# Altium project IBB.PrjPcb (part 11 of 12)
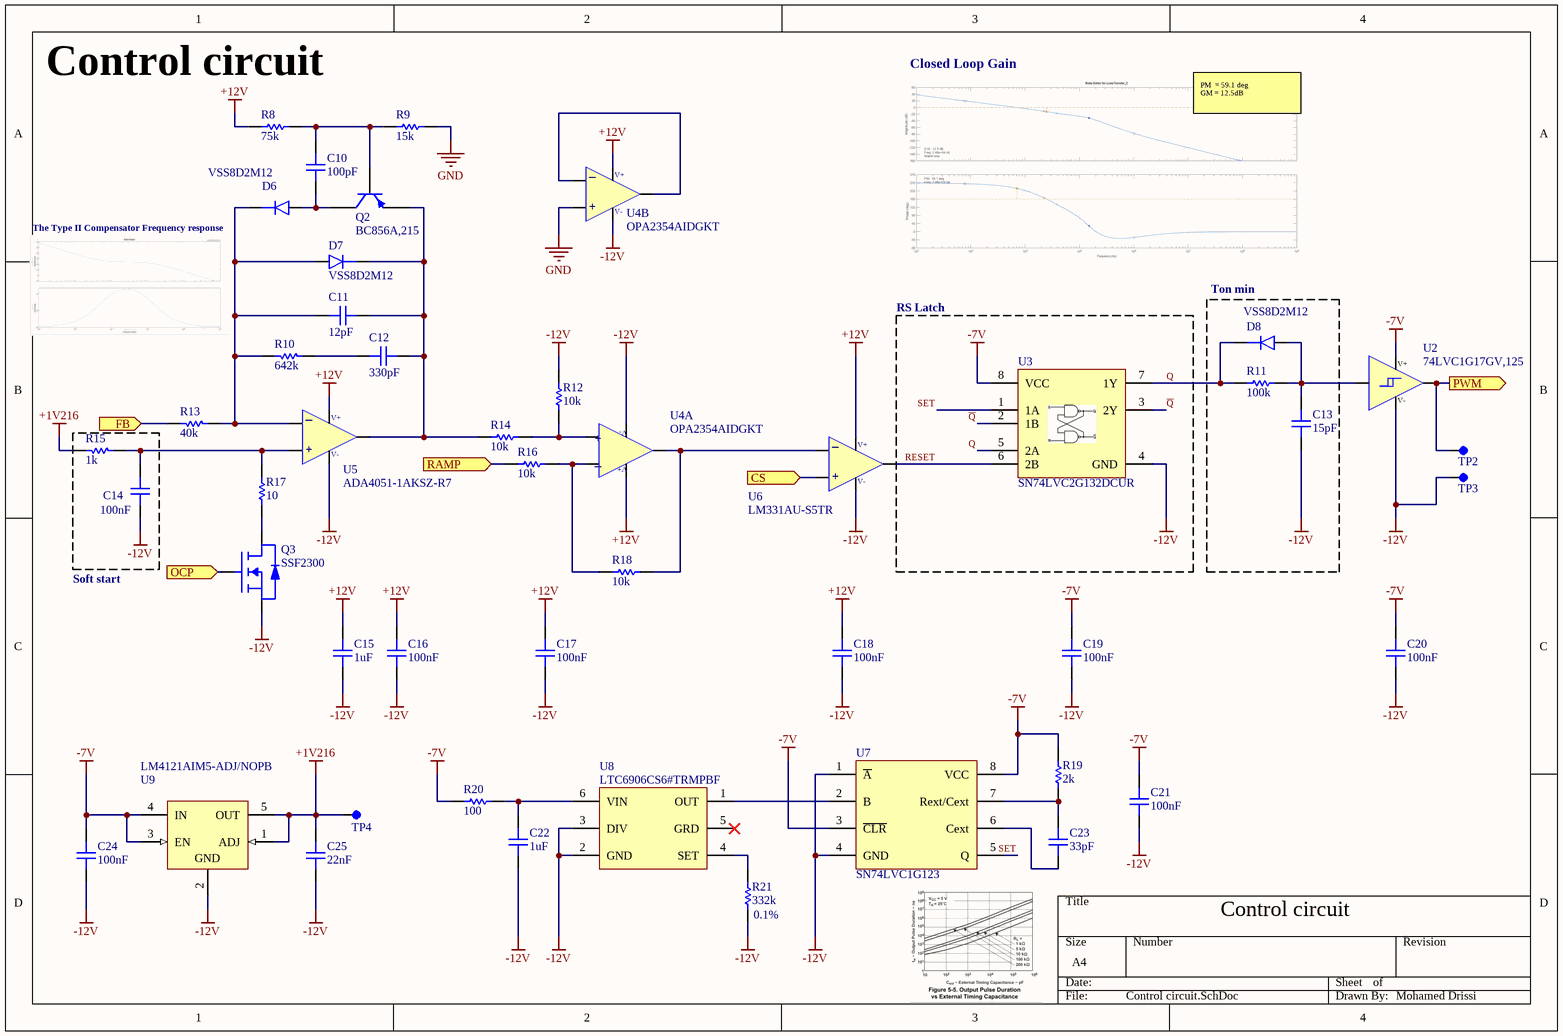
[diagram p16: Control circuit.SchDoc]

## Sheet Control circuit.SchDoc (continued)

### Library data of the parts (continued)
R12 R14 R16 R18 = Panasonic ERA-3AEB103V: Res Thin Film 0603 10K Ohm 0.1% 1/10W ±25ppm/°C Molded SMD SMD Punched Carrier T/R; Manufacturer Lifecycle Status: ACTIVE; Part Series: Thin Film Chip Resistors, High Reliability Type; Max Power Dissipation: 100mW; Voltage Rating: 75V; Supplier: RS; Supplier Part Number: 566890P; Manufacturer: Panasonic; Manufacturer Part Number: ERA-3AEB103V; RoHS: Compliant; Category: Chip SMD Resistors; Stock: 165600; Pricing: 50=0,056, 100=0,046, 250=0,04, 500=0,036 (EUR); Case/Package: 0603; Case Code (Imperial): 0603; Composition: Thin Film; Contact Plating: Tin; Country of Origin: Japan; Depth: 800µm; Export Control Classification Number (ECCN) Code: EAR99; Height: 450µm; Harmonized Tariff Schedule (HTS) Code: 8533.21.00.30; Introduction Date: 2008-03-19; Lead Free: Lead Free; Length: 1.6mm; Lifecycle Status: Production; Max Operating Temperature: 155°C; Military Standard: Not; Min Operating Temperature: -55°C; Mounting Technology: Surface Mount; Pins: 2; Number of Terminals: 2; Number of Terminations: 2; Packaging: Cut Tape; Power Rating: 100mW; Radiation Hardening: No; Ratings: AEC-Q200; REACH SVHC: Yes; Schedule B: 8533210045, 8533210045|8533210045|8533210045|8533210045|8533210045|8533210045|8533210045|8533210045|8533210045|8533210045|8533210045|8533210045|8533210045|8533210045|8533210045|8533210045|8533210045|8533210045|8533210045|8533210045|8533210045|8533210045|8533210045|85; Temperature Coefficient: 25ppm/°C; Termination: SMD/SMT; Tolerance: 0.1%; Voltage Rating (DC): 75V; Width: 800µm; Working Voltage: 75V; ComponentLink1URL: https://datasheet.octopart.com:443/ERA-3AEB103V-Panasonic-datasheet-62287448.pdf?src-supplier=Newark; ComponentLink1Description: https://datasheet.octopart.com:443/ERA-3AEB103V-Panasonic-datasheet-62287448.pdf?src-supplier=Newark; ComponentLink2URL: https://datasheet.octopart.com:443/ERA-3AEB103V-Panasonic-datasheet-118567.pdf?src-supplier=Newark; ComponentLink2Description: https://datasheet.octopart.com:443/ERA-3AEB103V-Panasonic-datasheet-118567.pdf?src-supplier=Newark; ComponentLink3URL: https://datasheet.octopart.com:443/ERA-3AEB103V-Panasonic-datasheet-61114971.pdf?src-supplier=Newark; ComponentLink3Description: https://datasheet.octopart.com:443/ERA-3AEB103V-Panasonic-datasheet-61114971.pdf?src-supplier=Newark; ComponentLink4URL: https://datasheet.octopart.com:443/ERA3AEB103V-Panasonic-datasheet-22087624.pdf?src-supplier=Newark; ComponentLink4Description: https://datasheet.octopart.com:443/ERA3AEB103V-Panasonic-datasheet-22087624.pdf?src-supplier=Newark; ComponentLink5URL: https://sigma.octopart.com:443/138766958/technical_drawing/Panasonic-ERA-3AEB103V.pdf?src-supplier=Upverter; ComponentLink5Description: https://sigma.octopart.com:443/138766958/technical_drawing/Panasonic-ERA-3AEB103V.pdf?src-supplier=Upverter; ComponentLink6URL: https://datasheet.octopart.com:443/ERA-3AEB103V-Panasonic-datasheet-136531316.pdf?src-supplier=Farnell; ComponentLink6Description: https://datasheet.octopart.com:443/ERA-3AEB103V-Panasonic-datasheet-136531316.pdf?src-supplier=Farnell; ComponentLink7URL: https://datasheet.octopart.com:443/ERA-3AEB103V-Panasonic-datasheet-13266200.pdf?src-supplier=RS+(Formerly+Allied+Electronics); ComponentLink7Description: https://datasheet.octopart.com:443/ERA-3AEB103V-Panasonic-datasheet-13266200.pdf?src-supplier=RS+(Formerly+Allied+Electronics); ComponentLink8URL: https://datasheet.octopart.com:443/ERA-3AEB103V-Panasonic-datasheet-46744048.pdf?src-supplier=RS+(Formerly+Allied+Electronics); ComponentLink8Description: https://datasheet.octopart.com:443/ERA-3AEB103V-Panasonic-datasheet-46744048.pdf?src-supplier=RS+(Formerly+Allied+Electronics); ComponentLink9URL: https://datasheet.octopart.com:443/ERA-3AEB103V-Panasonic-datasheet-10840895.pdf?src-supplier=Future+Electronics; ComponentLink9Description: https://datasheet.octopart.com:443/ERA-3AEB103V-Panasonic-datasheet-10840895.pdf?src-supplier=Future+Electronics; ComponentLink10URL: https://datasheet.octopart.com:443/ERA-3AEB103V-Panasonic-datasheet-8367715.pdf?src-supplier=Future+Electronics; ComponentLink10Description: https://datasheet.octopart.com:443/ERA-3AEB103V-Panasonic-datasheet-8367715.pdf?src-supplier=Future+Electronics; ComponentLink11URL: https://datasheet.octopart.com:443/ERA-3AEB103V-Panasonic-datasheet-12510007.pdf?src-supplier=Future+Electronics; ComponentLink11Description: https://datasheet.octopart.com:443/ERA-3AEB103V-Panasonic-datasheet-12510007.pdf?src-supplier=Future+Electronics; ComponentLink12URL: https://datasheet.octopart.com:443/ERA-3AEB103V-Panasonic-datasheet-11763931.pdf?src-supplier=Future+Electronics; ComponentLink12Description: https://datasheet.octopart.com:443/ERA-3AEB103V-Panasonic-datasheet-11763931.pdf?src-supplier=Future+Electronics; ComponentLink13URL: https://datasheet.octopart.com:443/ERA-3AEB103V-Panasonic-datasheet-5392808.pdf?src-supplier=Future+Electronics; ComponentLink13Description: https://datasheet.octopart.com:443/ERA-3AEB103V-Panasonic-datasheet-5392808.pdf?src-supplier=Future+Electronics; ComponentLink14URL: https://datasheet.octopart.com:443/ERA-3AEB103V-Panasonic-datasheet-154766165.pdf?src-supplier=Master+Electronics; ComponentLink14Description: https://datasheet.octopart.com:443/ERA-3AEB103V-Panasonic-datasheet-154766165.pdf?src-supplier=Master+Electronics; ComponentLink15URL: https://datasheet.octopart.com:443/ERA3AEB103V-Panasonic-datasheet-188913046.pdf?src-supplier=TME; ComponentLink15Description: https://datasheet.octopart.com:443/ERA3AEB103V-Panasonic-datasheet-188913046.pdf?src-supplier=TME; ComponentLink16URL: https://sigma.octopart.com:443/150570796/technical_drawing/Panasonic-ERA3AEB103V.pdf?src-supplier=Panasonic+SCT; ComponentLink16Description: https://sigma.octopart.com:443/150570796/technical_drawing/Panasonic-ERA3AEB103V.pdf?src-supplier=Panasonic+SCT; ComponentLink17URL: https://datasheet.octopart.com:443/ERA3AEB103V-Panasonic-datasheet-138783076.pdf?src-supplier=Burklin+Elektronik; ComponentLink17Description: https://datasheet.octopart.com:443/ERA3AEB103V-Panasonic-datasheet-138783076.pdf?src-supplier=Burklin+Elektronik; ComponentLink18URL: https://datasheet.octopart.com/ERA-3AEB103V-Panasonic-datasheet-78375410.pdf; ComponentLink18Description: https://datasheet.octopart.com/ERA-3AEB103V-Panasonic-datasheet-78375410.pdf; ComponentLink19URL: https://datasheet.octopart.com:443/ERA-3AEB103V-Panasonic-datasheet-10050158.pdf?src-supplier=Arrow+Electronics; ComponentLink19Description: https://datasheet.octopart.com:443/ERA-3AEB103V-Panasonic-datasheet-10050158.pdf?src-supplier=Arrow+Electronics; ComponentLink20URL: https://datasheet.octopart.com:443/ERA-3AEB103V-Panasonic-datasheet-33006989.pdf?src-supplier=Electro+Sonic; ComponentLink20Description: https://datasheet.octopart.com:443/ERA-3AEB103V-Panasonic-datasheet-33006989.pdf?src-supplier=Electro+Sonic
R13 = Yageo AT0603BRD0740KL: 100mW Thin Film Resistor ±25ppm/℃ ±0.1% 40kΩ 0603 Chip Resistor - Surface Mount ROHS; Manufacturer: Yageo Group; Temperature Coefficient: 25ppm/°C; Voltage Rating: 75V; Supplier: Farnell; Supplier Part Number: AT0603BRD0740KL; Manufacturer Part Number: AT0603BRD0740KL; RoHS: Compliant; Category: Chip SMD Resistors; Stock: 3360; Pricing: 10=0,106, 100=0,0857, 500=0,0736, 1000=0,0731, 2500=0,0726, 5000=0,0721 (GBP); Case/Package: 0603; China RoHS: Compliant; Composition: Thin Film; Country of Origin: Mainland China, Taiwan; Export Control Classification Number (ECCN) Code: EAR99; Height: 450µm; Harmonized Tariff Schedule (HTS) Code: 8533.21.00.30; Introduction Date: 2023-09-04; Length: 1.6mm; Lifecycle Status: Production; Max Operating Temperature: 155°C; Min Operating Temperature: -55°C; Mounting Technology: Surface Mount; Number of Terminals: 2; Power Rating: 100mW; Ratings: AEC-Q200; REACH SVHC: Yes; Tolerance: 0.1%; Width: 800µm; Working Voltage: 75V; ComponentLink1URL: https://datasheet.octopart.com:443/AT0603BRD0740KL-Yageo-datasheet-182189409.pdf?src-supplier=IHS; ComponentLink1Description: https://datasheet.octopart.com:443/AT0603BRD0740KL-Yageo-datasheet-182189409.pdf?src-supplier=IHS; ComponentLink2URL: https://datasheet.octopart.com:443/AT0603BRD0740KL-Yageo-datasheet-153645570.pdf?src-supplier=Upverter; ComponentLink2Description: https://datasheet.octopart.com:443/AT0603BRD0740KL-Yageo-datasheet-153645570.pdf?src-supplier=Upverter; ComponentLink3URL: https://sigma.octopart.com:443/138820526/technical_drawing/Yageo-AT0603BRD0740KL.pdf?src-supplier=Upverter; ComponentLink3Description: https://sigma.octopart.com:443/138820526/technical_drawing/Yageo-AT0603BRD0740KL.pdf?src-supplier=Upverter; ComponentLink4URL: https://datasheet.octopart.com:443/AT0603BRD0740KL-Yageo-datasheet-178056449.pdf?src-supplier=element14+APAC; ComponentLink4Description: https://datasheet.octopart.com:443/AT0603BRD0740KL-Yageo-datasheet-178056449.pdf?src-supplier=element14+APAC; ComponentLink5URL: http://sigma.octopart.com:80/conflict_mineral_statement/Yageo-company-3.pdf?src-supplier=Compliance+Statements; ComponentLink5Description: http://sigma.octopart.com:80/conflict_mineral_statement/Yageo-company-3.pdf?src-supplier=Compliance+Statements; ComponentLink6URL: http://sigma.octopart.com:80/rohs_statement/Yageo-company-2.pdf?src-supplier=Compliance+Statements; ComponentLink6Description: http://sigma.octopart.com:80/rohs_statement/Yageo-company-2.pdf?src-supplier=Compliance+Statements
R15 = Yageo RC0603FR-071KL: Res Thick Film 0603 1K Ohm 1% 0.1W(1/10W) ±100ppm/°C Pad SMD T/R / RES SMD 1K OHM 1% 1/10W 0603; Manufacturer: Yageo Group; Power Rating: 100mW; Voltage Rating: 50V; Working Voltage: 75V; Supplier: RS; Supplier Part Number: 1995479P; Manufacturer Part Number: RC0603FR-071KL; RoHS: Compliant; Category: Chip SMD Resistors; Stock: 83300; Pricing: 1000=0,007, 2500=0,007, 5000=0,006, 10000=0,005 (EUR); Case/Package: 0603; Case Code (Imperial): 0603; Case Code (Metric): 0603; China RoHS: Non-Compliant; Composition: Thick Film; Contact Plating: Tin; Country of Origin: Mainland China, Taiwan; Depth: 800µm; Export Control Classification Number (ECCN) Code: EAR99; Height: 450µm; Harmonized Tariff Schedule (HTS) Code: 8533.21.00.30; Introduction Date: 2004-10-04; Lead Free: Lead Free; Length: 1.6mm; Lifecycle Status: Production; Max Operating Temperature: 155°C; Military Standard: Not; Min Operating Temperature: -55°C; Mounting Technology: Surface Mount; Pins: 2; Number of Terminals: 2; Packaging: Tape and Reel; Radiation Hardening: No; REACH SVHC: Yes; Schedule B: 8533210045, 8533210045|8533210045|8533210045|8533210045|8533210045|8533210045|8533210045|8533210045|8533210045|8533210045|8533210045|8533210045|8533210045|8533210045|8533210045|8533210045|8533210045|8533210045|8533210045|8533210045|8533210045|8533210045|8533210045|85; Temperature Coefficient: 100ppm/°C; Termination: SMD/SMT; Tolerance: 1%; Voltage Rating (DC): 50V; Width: 800µm; ComponentLink1URL: https://datasheet.octopart.com:443/RC0603FR-071KL-Yageo-datasheet-175887523.pdf?src-supplier=Newark; ComponentLink1Description: https://datasheet.octopart.com:443/RC0603FR-071KL-Yageo-datasheet-175887523.pdf?src-supplier=Newark; ComponentLink2URL: https://datasheet.octopart.com:443/RC0603FR-071KL-Yageo-datasheet-34211833.pdf?src-supplier=Newark; ComponentLink2Description: https://datasheet.octopart.com:443/RC0603FR-071KL-Yageo-datasheet-34211833.pdf?src-supplier=Newark; ComponentLink3URL: https://datasheet.octopart.com:443/RC0603FR-071KL-Yageo-datasheet-12596169.pdf?src-supplier=Newark; ComponentLink3Description: https://datasheet.octopart.com:443/RC0603FR-071KL-Yageo-datasheet-12596169.pdf?src-supplier=Newark; ComponentLink4URL: https://datasheet.octopart.com:443/RC0603FR-071KL-Yageo-datasheet-499455.pdf?src-supplier=Newark; ComponentLink4Description: https://datasheet.octopart.com:443/RC0603FR-071KL-Yageo-datasheet-499455.pdf?src-supplier=Newark; ComponentLink5URL: https://datasheet.octopart.com:443/RC0603FR-071KL-Yageo-datasheet-503470.pdf?src-supplier=Newark; ComponentLink5Description: https://datasheet.octopart.com:443/RC0603FR-071KL-Yageo-datasheet-503470.pdf?src-supplier=Newark; ComponentLink6URL: https://datasheet.octopart.com:443/RC0603FR-071KL-Yageo-datasheet-62067350.pdf?src-supplier=element14+APAC; ComponentLink6Description: https://datasheet.octopart.com:443/RC0603FR-071KL-Yageo-datasheet-62067350.pdf?src-supplier=element14+APAC; ComponentLink7URL: https://datasheet.octopart.com:443/RC0603FR-071KL-Yageo-datasheet-21426514.pdf?src-supplier=element14+APAC; ComponentLink7Description: https://datasheet.octopart.com:443/RC0603FR-071KL-Yageo-datasheet-21426514.pdf?src-supplier=element14+APAC; ComponentLink8URL: https://datasheet.octopart.com:443/RC0603FR-071KL-Yageo-datasheet-141265859.pdf?src-supplier=Upverter; ComponentLink8Description: https://datasheet.octopart.com:443/RC0603FR-071KL-Yageo-datasheet-141265859.pdf?src-supplier=Upverter; ComponentLink9URL: https://datasheet.octopart.com:443/RC0603FR-071KL-Yageo-datasheet-103092701.pdf?src-supplier=Upverter; ComponentLink9Description: https://datasheet.octopart.com:443/RC0603FR-071KL-Yageo-datasheet-103092701.pdf?src-supplier=Upverter; ComponentLink10URL: https://sigma.octopart.com:443/138820526/technical_drawing/Yageo-RC0603FR-071KL.pdf?src-supplier=Upverter; ComponentLink10Description: https://sigma.octopart.com:443/138820526/technical_drawing/Yageo-RC0603FR-071KL.pdf?src-supplier=Upverter; ComponentLink11URL: https://datasheet.octopart.com:443/RC0603FR-071KL-Yageo-datasheet-68297981.pdf?src-supplier=Upverter; ComponentLink11Description: https://datasheet.octopart.com:443/RC0603FR-071KL-Yageo-datasheet-68297981.pdf?src-supplier=Upverter; ComponentLink12URL: https://datasheet.octopart.com:443/RC0603FR-071KL-Yageo-datasheet-8328172.pdf?src-supplier=Farnell; ComponentLink12Description: https://datasheet.octopart.com:443/RC0603FR-071KL-Yageo-datasheet-8328172.pdf?src-supplier=Farnell; ComponentLink13URL: https://datasheet.octopart.com:443/RC0603FR-071KL-Yageo-datasheet-13691069.pdf?src-supplier=Farnell; ComponentLink13Description: https://datasheet.octopart.com:443/RC0603FR-071KL-Yageo-datasheet-13691069.pdf?src-supplier=Farnell; ComponentLink14URL: https://datasheet.octopart.com:443/RC0603FR-071KL-Yageo-datasheet-15599030.pdf?src-supplier=Seeed+Studio; ComponentLink14Description: https://datasheet.octopart.com:443/RC0603FR-071KL-Yageo-datasheet-15599030.pdf?src-supplier=Seeed+Studio; ComponentLink15URL: https://datasheet.octopart.com:443/RC0603FR-071KL-Yageo-Group-datasheet-176638170.pdf?src-supplier=Future+Electronics; ComponentLink15Description: https://datasheet.octopart.com:443/RC0603FR-071KL-Yageo-Group-datasheet-176638170.pdf?src-supplier=Future+Electronics; ComponentLink16URL: https://datasheet.octopart.com:443/RC0603FR-071KL-Yageo-datasheet-164759695.pdf?src-supplier=Future+Electronics; ComponentLink16Description: https://datasheet.octopart.com:443/RC0603FR-071KL-Yageo-datasheet-164759695.pdf?src-supplier=Future+Electronics; ComponentLink17URL: https://datasheet.octopart.com:443/RC0603FR-071KL-Yageo-datasheet-137700087.pdf?src-supplier=Future+Electronics; ComponentLink17Description: https://datasheet.octopart.com:443/RC0603FR-071KL-Yageo-datasheet-137700087.pdf?src-supplier=Future+Electronics; ComponentLink18URL: https://datasheet.octopart.com:443/RC0603FR071KL-Yageo-datasheet-27584510.pdf?src-supplier=Future+Electronics; ComponentLink18Description: https://datasheet.octopart.com:443/RC0603FR071KL-Yageo-datasheet-27584510.pdf?src-supplier=Future+Electronics; ComponentLink19URL: https://datasheet.octopart.com:443/RC0603FR-071KL-Yageo-datasheet-8324193.pdf?src-supplier=Future+Electronics; ComponentLink19Description: https://datasheet.octopart.com:443/RC0603FR-071KL-Yageo-datasheet-8324193.pdf?src-supplier=Future+Electronics; ComponentLink20URL: https://datasheet.octopart.com:443/RC0603FR-071KL-Yageo-datasheet-79472498.pdf?src-supplier=Megastar; ComponentLink20Description: https://datasheet.octopart.com:443/RC0603FR-071KL-Yageo-datasheet-79472498.pdf?src-supplier=Megastar; ComponentLink21URL: https://datasheet.octopart.com/RC0603FR-071KL-Yageo-datasheet-73766026.pdf; ComponentLink21Description: https://datasheet.octopart.com/RC0603FR-071KL-Yageo-datasheet-73766026.pdf; ComponentLink22URL: https://datasheet.octopart.com:443/RC0603FR-071KL-Yageo-datasheet-118562.pdf?src-supplier=DigiKey; ComponentLink22Description: https://datasheet.octopart.com:443/RC0603FR-071KL-Yageo-datasheet-118562.pdf?src-supplier=DigiKey; ComponentLink23URL: http://sigma.octopart.com:80/conflict_mineral_statement/Yageo-company-3.pdf?src-supplier=Compliance+Statements; ComponentLink23Description: http://sigma.octopart.com:80/conflict_mineral_statement/Yageo-company-3.pdf?src-supplier=Compliance+Statements; ComponentLink24URL: http://sigma.octopart.com:80/rohs_statement/Yageo-company-2.pdf?src-supplier=Compliance+Statements; ComponentLink24Description: http://sigma.octopart.com:80/rohs_statement/Yageo-company-2.pdf?src-supplier=Compliance+Statements
R17 = Yageo RC0603FR-0710RL: Res Thick Film 0603 10 Ohm 1% 0.1W(1/10W) ±200ppm/C Pad SMD T/R
R19 = Yageo RT0603BRD072KL: Res Thin Film 0603 2K Ohm 0.1% 1/10W ±25ppm/°C Molded SMD SMD Paper T/R; Manufacturer: Yageo Group; Max Power Dissipation: 100mW; Voltage Rating: 75V; Voltage Rating (DC): 50V; Supplier: RS; Supplier Part Number: 1991499P; Manufacturer Part Number: RT0603BRD072KL; RoHS: Compliant; Category: Chip SMD Resistors; Stock: 1300; Pricing: 100=0,059, 250=0,049, 500=0,038, 1000=0,032 (EUR); Case/Package: 0603; Case Code (Imperial): 0603; China RoHS: Non-Compliant; Composition: Thin Film; Contact Plating: Tin; Depth: 800µm; Features: Moisture Resistant; Height: 450µm; Lead Free: Lead Free; Length: 1.6mm; Lifecycle Status: Production; Max Operating Temperature: 155°C; Military Standard: Not; Min Operating Temperature: -55°C; Mounting Technology: Surface Mount; Number of Terminals: 2; Number of Terminations: 2; Power Rating: 100mW; Radiation Hardening: No; REACH SVHC: Yes; Schedule B: 8533210045, 8533210045|8533210045|8533210045|8533210045|8533210045; Temperature Coefficient: 25ppm/°C; Termination: SMD/SMT; Tolerance: 0.1%; Weight: 2.012816mg; Width: 800µm; Working Voltage: 75V; ComponentLink1URL: https://datasheet.octopart.com:443/RT0603BRD072KL-Yageo-datasheet-176402239.pdf?src-supplier=Future+Electronics; ComponentLink1Description: https://datasheet.octopart.com:443/RT0603BRD072KL-Yageo-datasheet-176402239.pdf?src-supplier=Future+Electronics; ComponentLink2URL: https://datasheet.octopart.com:443/RT0603BRD072KL-Yageo-datasheet-169971040.pdf?src-supplier=Future+Electronics; ComponentLink2Description: https://datasheet.octopart.com:443/RT0603BRD072KL-Yageo-datasheet-169971040.pdf?src-supplier=Future+Electronics; ComponentLink3URL: https://datasheet.octopart.com:443/RT0603BRD072KL-Yageo-datasheet-166250672.pdf?src-supplier=Future+Electronics; ComponentLink3Description: https://datasheet.octopart.com:443/RT0603BRD072KL-Yageo-datasheet-166250672.pdf?src-supplier=Future+Electronics; ComponentLink4URL: https://datasheet.octopart.com:443/RT0603BRD072KL-Yageo-datasheet-136673517.pdf?src-supplier=Future+Electronics; ComponentLink4Description: https://datasheet.octopart.com:443/RT0603BRD072KL-Yageo-datasheet-136673517.pdf?src-supplier=Future+Electronics; ComponentLink5URL: https://datasheet.octopart.com:443/RT0603BRD072KL-Yageo-datasheet-137700930.pdf?src-supplier=Future+Electronics; ComponentLink5Description: https://datasheet.octopart.com:443/RT0603BRD072KL-Yageo-datasheet-137700930.pdf?src-supplier=Future+Electronics; ComponentLink6URL: https://datasheet.octopart.com:443/RT0603BRD072KL-Yageo-datasheet-96443642.pdf?src-supplier=Future+Electronics; ComponentLink6Description: https://datasheet.octopart.com:443/RT0603BRD072KL-Yageo-datasheet-96443642.pdf?src-supplier=Future+Electronics; ComponentLink7URL: https://datasheet.octopart.com:443/RT0603BRD072KL-Yageo-datasheet-12594463.pdf?src-supplier=Future+Electronics; ComponentLink7Description: https://datasheet.octopart.com:443/RT0603BRD072KL-Yageo-datasheet-12594463.pdf?src-supplier=Future+Electronics; ComponentLink8URL: https://datasheet.octopart.com:443/RT0603BRD072KL-Yageo-datasheet-10915759.pdf?src-supplier=Future+Electronics; ComponentLink8Description: https://datasheet.octopart.com:443/RT0603BRD072KL-Yageo-datasheet-10915759.pdf?src-supplier=Future+Electronics; ComponentLink9URL: https://datasheet.octopart.com:443/RT0603BRD072KL-Yageo-datasheet-8324589.pdf?src-supplier=Future+Electronics; ComponentLink9Description: https://datasheet.octopart.com:443/RT0603BRD072KL-Yageo-datasheet-8324589.pdf?src-supplier=Future+Electronics; ComponentLink10URL: https://datasheet.octopart.com:443/RT0603BRD072KL-Yageo-datasheet-34924148.pdf?src-supplier=Future+Electronics; ComponentLink10Description: https://datasheet.octopart.com:443/RT0603BRD072KL-Yageo-datasheet-34924148.pdf?src-supplier=Future+Electronics; ComponentLink11URL: https://datasheet.octopart.com:443/RT0603BRD072KL-Yageo-Group-datasheet-141265893.pdf?src-supplier=ODG+(Origin+Data+Global); ComponentLink11Description: https://datasheet.octopart.com:443/RT0603BRD072KL-Yageo-Group-datasheet-141265893.pdf?src-supplier=ODG+(Origin+Data+Global); ComponentLink12URL: https://datasheet.octopart.com:443/RT0603BRD072KL-Yageo-datasheet-120102479.pdf?src-supplier=Megastar; ComponentLink12Description: https://datasheet.octopart.com:443/RT0603BRD072KL-Yageo-datasheet-120102479.pdf?src-supplier=Megastar; ComponentLink13URL: https://datasheet.octopart.com/RT0603BRD072KL-Yageo-datasheet-86813807.pdf; ComponentLink13Description: https://datasheet.octopart.com/RT0603BRD072KL-Yageo-datasheet-86813807.pdf; ComponentLink14URL: http://sigma.octopart.com:80/conflict_mineral_statement/Yageo-company-3.pdf?src-supplier=Compliance+Statements; ComponentLink14Description: http://sigma.octopart.com:80/conflict_mineral_statement/Yageo-company-3.pdf?src-supplier=Compliance+Statements; ComponentLink15URL: http://sigma.octopart.com:80/rohs_statement/Yageo-company-2.pdf?src-supplier=Compliance+Statements; ComponentLink15Description: http://sigma.octopart.com:80/rohs_statement/Yageo-company-2.pdf?src-supplier=Compliance+Statements
R20 = Yageo RC0603FR-07100RL: Yageo RC0603FR-07100RL 0603 SMD Resistor 100 Ohm thin film chip resistor; Manufacturer: Yageo Group; Power Rating: 100mW; Temperature Coefficient: 100ppm/°C; Tolerance: 1%; Voltage Rating: 75V; Voltage Rating (DC): 50V; Supplier: RS; Supplier Part Number: 1995441P; Manufacturer Part Number: RC0603FR-07100RL; RoHS: Compliant; Category: Chip SMD Resistors; Stock: 48300; Pricing: 1000=0,007, 2500=0,007, 5000=0,006, 10000=0,005 (EUR); Case/Package: 0603; Case Code (Imperial): 0603; Case Code (Metric): 0603; China RoHS: Non-Compliant; Composition: Thick Film; Contact Plating: Tin; Depth: 800µm; Height: 450µm; Lead Free: Lead Free; Length: 1.6mm; Lifecycle Status: Production; Max Operating Temperature: 155°C; Military Standard: Not; Min Operating Temperature: -55°C; Mounting Technology: Surface Mount; Pins: 2; Number of Terminals: 2; Packaging: Cut Tape (CT); Radiation Hardening: No; REACH SVHC: Yes; Schedule B: 8533210045, 8533210045|8533210045|8533210045|8533210045|8533210045|8533210045|8533210045|8533210045|8533210045|8533210045|8533210045|8533210045|8533210045|8533210045|8533210045|8533210045|8533210045|8533210045|8533210045|8533210045|8533210045|8533210045|8533210045|85; Termination: SMD/SMT; Width: 800µm; Working Voltage: 75V; ComponentLink1URL: https://datasheet.octopart.com:443/RC0603FR-07100RL-Yageo-datasheet-175887523.pdf?src-supplier=IHS; ComponentLink1Description: https://datasheet.octopart.com:443/RC0603FR-07100RL-Yageo-datasheet-175887523.pdf?src-supplier=IHS; ComponentLink2URL: https://datasheet.octopart.com:443/RC0603FR-07100RL-Yageo-datasheet-8328172.pdf?src-supplier=Newark; ComponentLink2Description: https://datasheet.octopart.com:443/RC0603FR-07100RL-Yageo-datasheet-8328172.pdf?src-supplier=Newark; ComponentLink3URL: https://datasheet.octopart.com:443/RC0603FR-07100RL-Yageo-datasheet-34211833.pdf?src-supplier=Newark; ComponentLink3Description: https://datasheet.octopart.com:443/RC0603FR-07100RL-Yageo-datasheet-34211833.pdf?src-supplier=Newark; ComponentLink4URL: https://datasheet.octopart.com:443/RC0603FR-07100RL-Yageo-datasheet-103092701.pdf?src-supplier=Upverter; ComponentLink4Description: https://datasheet.octopart.com:443/RC0603FR-07100RL-Yageo-datasheet-103092701.pdf?src-supplier=Upverter; ComponentLink5URL: https://datasheet.octopart.com:443/RC0603FR-07100RL-Yageo-datasheet-62067350.pdf?src-supplier=element14+APAC; ComponentLink5Description: https://datasheet.octopart.com:443/RC0603FR-07100RL-Yageo-datasheet-62067350.pdf?src-supplier=element14+APAC; ComponentLink6URL: https://datasheet.octopart.com:443/RC0603FR-07100RL-Yageo-datasheet-17842380.pdf?src-supplier=element14+APAC; ComponentLink6Description: https://datasheet.octopart.com:443/RC0603FR-07100RL-Yageo-datasheet-17842380.pdf?src-supplier=element14+APAC; ComponentLink7URL: https://datasheet.octopart.com:443/RC0603FR-07100RL-Yageo-datasheet-12596169.pdf?src-supplier=Future+Electronics; ComponentLink7Description: https://datasheet.octopart.com:443/RC0603FR-07100RL-Yageo-datasheet-12596169.pdf?src-supplier=Future+Electronics; ComponentLink8URL: https://datasheet.octopart.com:443/RC0603FR-07100RL-Yageo-Group-datasheet-176638170.pdf?src-supplier=Future+Electronics; ComponentLink8Description: https://datasheet.octopart.com:443/RC0603FR-07100RL-Yageo-Group-datasheet-176638170.pdf?src-supplier=Future+Electronics; ComponentLink9URL: https://datasheet.octopart.com:443/RC0603FR-07100RL-Yageo-datasheet-164759695.pdf?src-supplier=Future+Electronics; ComponentLink9Description: https://datasheet.octopart.com:443/RC0603FR-07100RL-Yageo-datasheet-164759695.pdf?src-supplier=Future+Electronics; ComponentLink10URL: https://datasheet.octopart.com:443/RC0603FR-07100RL-Yageo-datasheet-137700087.pdf?src-supplier=Future+Electronics; ComponentLink10Description: https://datasheet.octopart.com:443/RC0603FR-07100RL-Yageo-datasheet-137700087.pdf?src-supplier=Future+Electronics; ComponentLink11URL: https://datasheet.octopart.com:443/RC0603FR07100RL-Yageo-datasheet-27584510.pdf?src-supplier=Future+Electronics; ComponentLink11Description: https://datasheet.octopart.com:443/RC0603FR07100RL-Yageo-datasheet-27584510.pdf?src-supplier=Future+Electronics; ComponentLink12URL: https://datasheet.octopart.com:443/RC0603FR-07100RL-Yageo-datasheet-15599030.pdf?src-supplier=Future+Electronics; ComponentLink12Description: https://datasheet.octopart.com:443/RC0603FR-07100RL-Yageo-datasheet-15599030.pdf?src-supplier=Future+Electronics; ComponentLink13URL: https://datasheet.octopart.com:443/RC0603FR-07100RL-Yageo-datasheet-8324193.pdf?src-supplier=Future+Electronics; ComponentLink13Description: https://datasheet.octopart.com:443/RC0603FR-07100RL-Yageo-datasheet-8324193.pdf?src-supplier=Future+Electronics; ComponentLink14URL: https://datasheet.octopart.com:443/RC0603FR-07100RL-Yageo-datasheet-79472498.pdf?src-supplier=Megastar; ComponentLink14Description: https://datasheet.octopart.com:443/RC0603FR-07100RL-Yageo-datasheet-79472498.pdf?src-supplier=Megastar; ComponentLink15URL: https://datasheet.octopart.com/RC0603FR-07100RL-Yageo-datasheet-73766026.pdf; ComponentLink15Description: https://datasheet.octopart.com/RC0603FR-07100RL-Yageo-datasheet-73766026.pdf; ComponentLink16URL: https://datasheet.octopart.com:443/RC0603FR-07100RL-Yageo-datasheet-13691069.pdf?src-supplier=Farnell; ComponentLink16Description: https://datasheet.octopart.com:443/RC0603FR-07100RL-Yageo-datasheet-13691069.pdf?src-supplier=Farnell; ComponentLink17URL: https://datasheet.octopart.com:443/RC0603FR-07100RL-Yageo-datasheet-118562.pdf?src-supplier=DigiKey; ComponentLink17Description: https://datasheet.octopart.com:443/RC0603FR-07100RL-Yageo-datasheet-118562.pdf?src-supplier=DigiKey; ComponentLink18URL: http://sigma.octopart.com:80/conflict_mineral_statement/Yageo-company-3.pdf?src-supplier=Compliance+Statements; ComponentLink18Description: http://sigma.octopart.com:80/conflict_mineral_statement/Yageo-company-3.pdf?src-supplier=Compliance+Statements; ComponentLink19URL: http://sigma.octopart.com:80/rohs_statement/Yageo-company-2.pdf?src-supplier=Compliance+Statements; ComponentLink19Description: http://sigma.octopart.com:80/rohs_statement/Yageo-company-2.pdf?src-supplier=Compliance+Statements
R21 = Yageo RT0603BRD07332KL: 100mW Thin Film Resistor ±25ppm/℃ ±0.1% 332kΩ 0603 Chip Resistor - Surface Mount ROHS; Manufacturer: Yageo Group; Temperature Coefficient: 25ppm/°C; Voltage Rating: 75V; Voltage Rating (DC): 50V; Supplier: Farnell; Supplier Part Number: RT0603BRD07332KL; Manufacturer Part Number: RT0603BRD07332KL; RoHS: Compliant; Category: Chip SMD Resistors; Stock: 3900; Pricing: 10=0,0559, 100=0,0402, 500=0,0362, 1000=0,0347, 2500=0,034 (GBP); Case/Package: 0603; Case Code (Imperial): 0603; China RoHS: Non-Compliant; Composition: Thin Film; Contact Plating: Tin; Country of Origin: Mainland China, Taiwan; Depth: 800µm; Export Control Classification Number (ECCN) Code: EAR99; Height: 450µm; Harmonized Tariff Schedule (HTS) Code: 8533.21.00.30; Introduction Date: 2008-06-09; Lead Free: Lead Free; Length: 1.6mm; Lifecycle Status: Production; Max Operating Temperature: 155°C; Max Power Dissipation: 100mW; Military Standard: Not; Min Operating Temperature: -55°C; Mounting Technology: Surface Mount; Number of Terminals: 2; Number of Terminations: 2; Power Rating: 100mW; Radiation Hardening: No; REACH SVHC: Yes; Schedule B: 8533210045, 8533210045|8533210045, 8533210045|8533210045|8533210045, 8533210045|8533210045|8533210045|8533210045; Termination: SMD/SMT; Weight: 2.012816mg; Width: 800µm; Working Voltage: 75V; ComponentLink1URL: https://datasheet.octopart.com:443/RT0603BRD07332KL-Yageo-datasheet-176402239.pdf?src-supplier=Future+Electronics; ComponentLink1Description: https://datasheet.octopart.com:443/RT0603BRD07332KL-Yageo-datasheet-176402239.pdf?src-supplier=Future+Electronics; ComponentLink2URL: https://datasheet.octopart.com:443/RT0603BRD07332KL-Yageo-datasheet-169971040.pdf?src-supplier=Future+Electronics; ComponentLink2Description: https://datasheet.octopart.com:443/RT0603BRD07332KL-Yageo-datasheet-169971040.pdf?src-supplier=Future+Electronics; ComponentLink3URL: https://datasheet.octopart.com:443/RT0603BRD07332KL-Yageo-datasheet-166250672.pdf?src-supplier=Future+Electronics; ComponentLink3Description: https://datasheet.octopart.com:443/RT0603BRD07332KL-Yageo-datasheet-166250672.pdf?src-supplier=Future+Electronics; ComponentLink4URL: https://datasheet.octopart.com:443/RT0603BRD07332KL-Yageo-datasheet-137700930.pdf?src-supplier=Future+Electronics; ComponentLink4Description: https://datasheet.octopart.com:443/RT0603BRD07332KL-Yageo-datasheet-137700930.pdf?src-supplier=Future+Electronics; ComponentLink5URL: https://datasheet.octopart.com:443/RT0603BRD07332KL-Yageo-datasheet-96443642.pdf?src-supplier=Upverter; ComponentLink5Description: https://datasheet.octopart.com:443/RT0603BRD07332KL-Yageo-datasheet-96443642.pdf?src-supplier=Upverter; ComponentLink6URL: https://datasheet.octopart.com:443/RT0603BRD07332KL-Yageo-Group-datasheet-141265893.pdf?src-supplier=ODG+(Origin+Data+Global); ComponentLink6Description: https://datasheet.octopart.com:443/RT0603BRD07332KL-Yageo-Group-datasheet-141265893.pdf?src-supplier=ODG+(Origin+Data+Global); ComponentLink7URL: https://datasheet.octopart.com/RT0603BRD07332KL-Yageo-datasheet-86813807.pdf; ComponentLink7Description: https://datasheet.octopart.com/RT0603BRD07332KL-Yageo-datasheet-86813807.pdf; ComponentLink8URL: http://sigma.octopart.com:80/conflict_mineral_statement/Yageo-company-3.pdf?src-supplier=Compliance+Statements; ComponentLink8Description: http://sigma.octopart.com:80/conflict_mineral_statement/Yageo-company-3.pdf?src-supplier=Compliance+Statements; ComponentLink9URL: http://sigma.octopart.com:80/rohs_statement/Yageo-company-2.pdf?src-supplier=Compliance+Statements; ComponentLink9Description: http://sigma.octopart.com:80/rohs_statement/Yageo-company-2.pdf?src-supplier=Compliance+Statements
TP2-TP4 = Keystone 5000: Cable Wrap, 1/2 Inch, Polyethylene, Natural, 50 Ft, Spirap Series | TE Connectivity 500002-1; Body Material: Bronze, PBT; Hole Diameter: 1.6mm; Inside Diameter: 1.27mm; Insulation: Insulated; Number of Contacts: 1; Outside Diameter: 2.54mm; Plating: Silver; Supplier: Future Electronics; Supplier Part Number: 5000; Manufacturer: Keystone; Manufacturer Part Number: 5000; RoHS: Compliant; Category: Test Points; Stock: 278803; Pricing: 200=0,0998, 500=0,0974, 1500=0,0947, 3000=0,093, 10000=0,088 (USD); Color: Red; Contact Material: Silver; Contact Plating: Silver; Flammability Rating: UL94 V-0; Height: 4.72mm; Housing Color: Red; Lead Free: Lead Free; Length: 7.62mm; Lifecycle Status: Production; Material: Bronze, Nylon, Silver; Mounting Technology: PCB, Through Hole; Number of Ports: 1; Orientation: Straight; Packaging: Bulk; REACH SVHC: Yes; ComponentLink1URL: https://datasheet.octopart.com:443/5000-Keystone-datasheet-138896739.pdf?src-supplier=Upverter; ComponentLink1Description: https://datasheet.octopart.com:443/5000-Keystone-datasheet-138896739.pdf?src-supplier=Upverter; ComponentLink2URL: https://datasheet.octopart.com:443/5000-Keystone-datasheet-15716159.pdf?src-supplier=IHS; ComponentLink2Description: https://datasheet.octopart.com:443/5000-Keystone-datasheet-15716159.pdf?src-supplier=IHS; ComponentLink3URL: https://datasheet.octopart.com:443/5000-Keystone-datasheet-9590016.pdf?src-supplier=Sager+Electronics; ComponentLink3Description: https://datasheet.octopart.com:443/5000-Keystone-datasheet-9590016.pdf?src-supplier=Sager+Electronics; ComponentLink4URL: https://datasheet.octopart.com:443/5000-Keystone-datasheet-23674.pdf?src-supplier=SOS+electronic; ComponentLink4Description: https://datasheet.octopart.com:443/5000-Keystone-datasheet-23674.pdf?src-supplier=SOS+electronic; ComponentLink5URL: https://datasheet.octopart.com:443/5000-Keystone-datasheet-549598.pdf?src-supplier=Farnell; ComponentLink5Description: https://datasheet.octopart.com:443/5000-Keystone-datasheet-549598.pdf?src-supplier=Farnell; ComponentLink6URL: https://datasheet.octopart.com:443/5000-Keystone-datasheet-60278094.pdf?src-supplier=Future+Electronics; ComponentLink6Description: https://datasheet.octopart.com:443/5000-Keystone-datasheet-60278094.pdf?src-supplier=Future+Electronics; ComponentLink7URL: https://datasheet.octopart.com:443/5000-Keystone-datasheet-542585.pdf?src-supplier=Future+Electronics; ComponentLink7Description: https://datasheet.octopart.com:443/5000-Keystone-datasheet-542585.pdf?src-supplier=Future+Electronics; ComponentLink8URL: https://datasheet.octopart.com:443/5000-Keystone-datasheet-10925273.pdf?src-supplier=Factory+Futures; ComponentLink8Description: https://datasheet.octopart.com:443/5000-Keystone-datasheet-10925273.pdf?src-supplier=Factory+Futures; ComponentLink9URL: https://datasheet.octopart.com:443/5000-Keystone-datasheet-15983577.pdf?src-supplier=element14+APAC; ComponentLink9Description: https://datasheet.octopart.com:443/5000-Keystone-datasheet-15983577.pdf?src-supplier=element14+APAC; ComponentLink10URL: https://datasheet.octopart.com:443/5000-Keystone-datasheet-6528.pdf?src-supplier=RS+(Formerly+Allied+Electronics); ComponentLink10Description: https://datasheet.octopart.com:443/5000-Keystone-datasheet-6528.pdf?src-supplier=RS+(Formerly+Allied+Electronics)
U2 = NXP 74LVC1G17GV,125: Schmitt Trigger Buffer, Single, 1 Input, 5 Pins, TSOP, 74LVC1G17; Manufacturer: Nexperia; Manufacturer Lifecycle Status: RELEASED FOR SUPPLY; High Level Output Current: -32mA; Load Capacitance: 50pF; Logic Function: Buffer, Schmitt Trigger; Low Level Output Current: 24mA; Max Supply Voltage: 5.5V; Min Supply Voltage: 1.65V; Number of Bits per Element: 1; Operating Supply Voltage: 1.8V; Polarity: Non-Inverting; Propagation Delay: 7ns; Quiescent Current: 200µA; Schmitt Trigger Input: Yes; Turn-On Delay Time: 14ns; Supplier: DigiKey; Supplier Part Number: 1727-6070-1-ND; Manufacturer Part Number: 74LVC1G17GV,125; RoHS: Compliant; Category: Logic Gates; Stock: 58843; Pricing: 1=0,1, 10=0,069, 25=0,0604, 100=0,0509, 250=0,04628, 500=0,04348, 1000=0,04119 (USD); Case/Package: TSOP; China RoHS: Compliant; Contact Plating: Tin; Height - Seated (Max): 1.1mm; Harmonized Tariff Schedule (HTS) Code: 8542.39.00.01; Introduction Date: 2004-12-01; Lead Free: Lead Free; Length: 2.9mm; Lifecycle Status: Production; Max Operating Temperature: 125°C; Max Supply Voltage (DC): 5.5V; Max Voltage Rating (DC): 5.5V; Min Operating Temperature: -40°C; Min Supply Voltage (DC): 1.65V; Mounting Technology: Surface Mount; Number of Channels: 1; Number of Circuits: 1; Number of Elements: 1; Number of Input Lines: 1; Number of Inputs: 1; Number of Output Lines: 1; Number of Outputs: 1; Pins: 5; Number of Terminals: 5; Packaging: Tape & Reel; Radiation Hardening: No; REACH SVHC: Yes; Schedule B: 8542390000, 8542390000|8542390000|8542390000|8542390000|8542390000; Temperature Grade: Automotive; Terminal Pitch: 950µm; Width: 1.5mm; ComponentLink1URL: https://datasheet.octopart.com:443/74LVC1G17GV%2C125-Nexperia-datasheet-87842575.pdf?src-supplier=IHS; ComponentLink1Description: https://datasheet.octopart.com:443/74LVC1G17GV%2C125-Nexperia-datasheet-87842575.pdf?src-supplier=IHS; ComponentLink2URL: https://datasheet.octopart.com:443/74LVC1G17GV%2C125-Nexperia-datasheet-11799833.pdf?src-supplier=IHS; ComponentLink2Description: https://datasheet.octopart.com:443/74LVC1G17GV%2C125-Nexperia-datasheet-11799833.pdf?src-supplier=IHS; ComponentLink3URL: https://datasheet.octopart.com:443/74LVC1G17GV%2C125-Nexperia-datasheet-73818103.pdf?src-supplier=Newark; ComponentLink3Description: https://datasheet.octopart.com:443/74LVC1G17GV%2C125-Nexperia-datasheet-73818103.pdf?src-supplier=Newark; ComponentLink4URL: https://datasheet.octopart.com:443/74LVC1G17GV%2C125-NXP-Semiconductors-datasheet-13026859.pdf?src-supplier=Newark; ComponentLink4Description: https://datasheet.octopart.com:443/74LVC1G17GV%2C125-NXP-Semiconductors-datasheet-13026859.pdf?src-supplier=Newark; ComponentLink5URL: https://datasheet.octopart.com:443/74LVC1G17GV%2C125-Nexperia-datasheet-116120530.pdf?src-supplier=Future+Electronics; ComponentLink5Description: https://datasheet.octopart.com:443/74LVC1G17GV%2C125-Nexperia-datasheet-116120530.pdf?src-supplier=Future+Electronics; ComponentLink6URL: http://sigma.octopart.com:80/reach_statement/NXP-Semiconductors-company-13.pdf?src-supplier=Compliance+Statements; ComponentLink6Description: http://sigma.octopart.com:80/reach_statement/NXP-Semiconductors-company-13.pdf?src-supplier=Compliance+Statements; ComponentLink7URL: http://sigma.octopart.com:80/rohs_statement/NXP-Semiconductors-company-12.pdf?src-supplier=Compliance+Statements; ComponentLink7Description: http://sigma.octopart.com:80/rohs_statement/NXP-Semiconductors-company-12.pdf?src-supplier=Compliance+Statements
U3 = TI SN74LVC2G132DCUR: 2-ch, 2-input, 1.65-V to 5.5-V NAND gates with Schmitt-Trigger inputs 8-VSSOP -40 to 125; Manufacturer: Texas Instruments; Manufacturer Lifecycle Status: ACTIVE; Frequency: 10MHz; High Level Output Current: -32mA; Logic Function: Inverting; Low Level Output Current: 32mA; Max Supply Voltage: 5.5V; Min Supply Voltage: 1.65V; Nominal Supply Current: 10µA; Number of Bits: 2; Number of Inputs: 4; Number of Output Lines: 1; Output Current: 50mA; Propagation Delay: 5ns; Turn-On Delay Time: 6ns; Supplier: DigiKey; Supplier Part Number: 296-18802-1-ND; Manufacturer Part Number: SN74LVC2G132DCUR; RoHS: Compliant; Category: Logic Gates; Stock: 13934; Pricing: 1=0,41, 10=0,283, 25=0,2516, 100=0,2178, 250=0,20156, 500=0,19182, 1000=0,18377 (USD); Ambient Temperature Range High: 125°C; Case/Package: VSSOP; Contact Plating: Gold; Height: 900µm; Lead Free: Lead Free; Length: 2.3mm; Lifecycle Status: Production; Max Operating Temperature: 125°C; Min Operating Temperature: -40°C; Mounting Technology: Surface Mount; Number of Channels: 2; Number of Circuits: 2; Number of Elements: 2; Number of Gates: 2; Number of Input Lines: 2; Number of Outputs: 2; Pins: 8; Packaging: Cut Tape; Quiescent Current: 10µA; Radiation Hardening: No; REACH SVHC: No; Schedule B: 8542390000, 8542390000|8542390000, 8542390000|8542390000|8542390000, 8542390000|8542390000|8542390000|8542390000; Thickness: 850µm; Weight: 9.610488mg; Width: 2mm; ComponentLink1URL: https://sigma.octopart.com:443/167215082/technical_drawing/Texas-Instruments-SN74LVC2G132DCUR.pdf?src-supplier=Texas+Instruments; ComponentLink1Description: https://sigma.octopart.com:443/167215082/technical_drawing/Texas-Instruments-SN74LVC2G132DCUR.pdf?src-supplier=Texas+Instruments; ComponentLink2URL: https://octopart.com:443/opatz8j6/c1?t=dlLK3MRuxZ8-avrxMu5rxZmNhXQUiX2B0OyCF8DuAQvboW787mL228dgpibN22RUDHDl721KVNhVPMfSgh7ykVaRYJWydkx1mEa2bu9jbzaW3gLtwz_epjnJfasCWsLPAVM-hDv45KQqq4reNUai-gbLUwgXAqd2oetgMCZ8G4xihaqSuuqUBbzq4sKhfnsxFN7qau3BJOhm9KaFJ5o60V3QDGlN9pKGhgXh3Tarf94GHy6Lon0BV2sa2c2JDr6VbNTT_lTAXjau2Ji5j9fHwObcS2wwxBZa2CMqBDpZztCkKpJR2t9xwwNEbplJl1D3Ll7ulXV-5eVsJoDPHFKu2QDykVyyaZiPYygZg-MYKanKw_kIaILyTRRCZfgNEV9ZcMujTaeRstI&src-supplier=Texas+Instruments; ComponentLink2Description: https://octopart.com:443/opatz8j6/c1?t=dlLK3MRuxZ8-avrxMu5rxZmNhXQUiX2B0OyCF8DuAQvboW787mL228dgpibN22RUDHDl721KVNhVPMfSgh7ykVaRYJWydkx1mEa2bu9jbzaW3gLtwz_epjnJfasCWsLPAVM-hDv45KQqq4reNUai-gbLUwgXAqd2oetgMCZ8G4xihaqSuuqUBbzq4sKhfnsxFN7qau3BJOhm9KaFJ5o60V3QDGlN9pKGhgXh3Tarf94GHy6Lon0BV2sa2c2JDr6VbNTT_lTAXjau2Ji5j9fHwObcS2wwxBZa2CMqBDpZztCkKpJR2t9xwwNEbplJl1D3Ll7ulXV-5eVsJoDPHFKu2QDykVyyaZiPYygZg-MYKanKw_kIaILyTRRCZfgNEV9ZcMujTaeRstI&src-supplier=Texas+Instruments; ComponentLink3URL: https://datasheet.octopart.com:443/SN74LVC2G132DCUR-Texas-Instruments-datasheet-21772640.pdf?src-supplier=Texas+Instruments; ComponentLink3Description: https://datasheet.octopart.com:443/SN74LVC2G132DCUR-Texas-Instruments-datasheet-21772640.pdf?src-supplier=Texas+Instruments; ComponentLink4URL: https://datasheet.octopart.com:443/SN74LVC2G132DCUR-Texas-Instruments-datasheet-10254462.pdf?src-supplier=Texas+Instruments; ComponentLink4Description: https://datasheet.octopart.com:443/SN74LVC2G132DCUR-Texas-Instruments-datasheet-10254462.pdf?src-supplier=Texas+Instruments; ComponentLink5URL: https://datasheet.octopart.com:443/SN74LVC2G132DCUR-Texas-Instruments-datasheet-151477.pdf?src-supplier=Texas+Instruments; ComponentLink5Description: https://datasheet.octopart.com:443/SN74LVC2G132DCUR-Texas-Instruments-datasheet-151477.pdf?src-supplier=Texas+Instruments; ComponentLink6URL: https://sigma.octopart.com:443/49249948/technical_drawing/Texas-Instruments-SN74LVC2G132DCUR.pdf?src-supplier=Texas+Instruments; ComponentLink6Description: https://sigma.octopart.com:443/49249948/technical_drawing/Texas-Instruments-SN74LVC2G132DCUR.pdf?src-supplier=Texas+Instruments; ComponentLink7URL: https://datasheet.octopart.com:443/SN74LVC2G132DCUR-Texas-Instruments-datasheet-65713492.pdf?src-supplier=element14+APAC; ComponentLink7Description: https://datasheet.octopart.com:443/SN74LVC2G132DCUR-Texas-Instruments-datasheet-65713492.pdf?src-supplier=element14+APAC; ComponentLink8URL: https://datasheet.octopart.com:443/SN74LVC2G132DCUR.-Texas-Instruments-datasheet-62088896.pdf?src-supplier=element14+APAC; ComponentLink8Description: https://datasheet.octopart.com:443/SN74LVC2G132DCUR.-Texas-Instruments-datasheet-62088896.pdf?src-supplier=element14+APAC; ComponentLink9URL: https://datasheet.octopart.com:443/SN74LVC2G132DCUR-Texas-Instruments-datasheet-37732373.pdf?src-supplier=element14+APAC; ComponentLink9Description: https://datasheet.octopart.com:443/SN74LVC2G132DCUR-Texas-Instruments-datasheet-37732373.pdf?src-supplier=element14+APAC; ComponentLink10URL: https://datasheet.octopart.com:443/SN74LVC2G132DCUR-Texas-Instruments-datasheet-17022353.pdf?src-supplier=Farnell; ComponentLink10Description: https://datasheet.octopart.com:443/SN74LVC2G132DCUR-Texas-Instruments-datasheet-17022353.pdf?src-supplier=Farnell; ComponentLink11URL: https://datasheet.octopart.com:443/SN74LVC2G132DCUR.-Texas-Instruments-datasheet-37732357.pdf?src-supplier=Farnell; ComponentLink11Description: https://datasheet.octopart.com:443/SN74LVC2G132DCUR.-Texas-Instruments-datasheet-37732357.pdf?src-supplier=Farnell; ComponentLink12URL: https://datasheet.octopart.com:443/SN74LVC2G132DCUR-Texas-Instruments-datasheet-32750705.pdf?src-supplier=Farnell; ComponentLink12Description: https://datasheet.octopart.com:443/SN74LVC2G132DCUR-Texas-Instruments-datasheet-32750705.pdf?src-supplier=Farnell; ComponentLink13URL: https://datasheet.octopart.com:443/SN74LVC2G132DCUR-Texas-Instruments-datasheet-32026730.pdf?src-supplier=Farnell; ComponentLink13Description: https://datasheet.octopart.com:443/SN74LVC2G132DCUR-Texas-Instruments-datasheet-32026730.pdf?src-supplier=Farnell; ComponentLink14URL: https://datasheet.octopart.com:443/SN74LVC2G132DCUR-Texas-Instruments-datasheet-24897066.pdf?src-supplier=Farnell; ComponentLink14Description: https://datasheet.octopart.com:443/SN74LVC2G132DCUR-Texas-Instruments-datasheet-24897066.pdf?src-supplier=Farnell; ComponentLink15URL: https://datasheet.octopart.com:443/SN74LVC2G132DCUR-Texas-Instruments-datasheet-160738798.pdf?src-supplier=SHENGYU+ELECTRONICS; ComponentLink15Description: https://datasheet.octopart.com:443/SN74LVC2G132DCUR-Texas-Instruments-datasheet-160738798.pdf?src-supplier=SHENGYU+ELECTRONICS; ComponentLink16URL: https://datasheet.octopart.com:443/SN74LVC2G132DCUR-Texas-Instruments-datasheet-33011025.pdf?src-supplier=Newark; ComponentLink16Description: https://datasheet.octopart.com:443/SN74LVC2G132DCUR-Texas-Instruments-datasheet-33011025.pdf?src-supplier=Newark; ComponentLink17URL: https://datasheet.octopart.com:443/SN74LVC2G132DCUR-Texas-Instruments-datasheet-14148001.pdf?src-supplier=iiiC; ComponentLink17Description: https://datasheet.octopart.com:443/SN74LVC2G132DCUR-Texas-Instruments-datasheet-14148001.pdf?src-supplier=iiiC; ComponentLink18URL: https://datasheet.octopart.com:443/SN74LVC2G132DCUR-Texas-Instruments-datasheet-11549827.pdf?src-supplier=Arrow+Electronics; ComponentLink18Description: https://datasheet.octopart.com:443/SN74LVC2G132DCUR-Texas-Instruments-datasheet-11549827.pdf?src-supplier=Arrow+Electronics; ComponentLink19URL: https://datasheet.octopart.com:443/SN74LVC2G132DCUR-Texas-Instruments-datasheet-58692.pdf?src-supplier=DigiKey; ComponentLink19Description: https://datasheet.octopart.com:443/SN74LVC2G132DCUR-Texas-Instruments-datasheet-58692.pdf?src-supplier=DigiKey; ComponentLink20URL: https://datasheet.octopart.com:443/SN74LVC2G132DCUR-Texas-Instruments-datasheet-116307.pdf?src-supplier=Sierra+IC; ComponentLink20Description: https://datasheet.octopart.com:443/SN74LVC2G132DCUR-Texas-Instruments-datasheet-116307.pdf?src-supplier=Sierra+IC; ComponentLink21URL: http://sigma.octopart.com:80/reach_statement/Texas-Instruments-company-64.pdf?src-supplier=Compliance+Statements; ComponentLink21Description: http://sigma.octopart.com:80/reach_statement/Texas-Instruments-company-64.pdf?src-supplier=Compliance+Statements; ComponentLink22URL: http://sigma.octopart.com:80/conflict_mineral_statement/Texas-Instruments-company-63.pdf?src-supplier=Compliance+Statements; ComponentLink22Description: http://sigma.octopart.com:80/conflict_mineral_statement/Texas-Instruments-company-63.pdf?src-supplier=Compliance+Statements